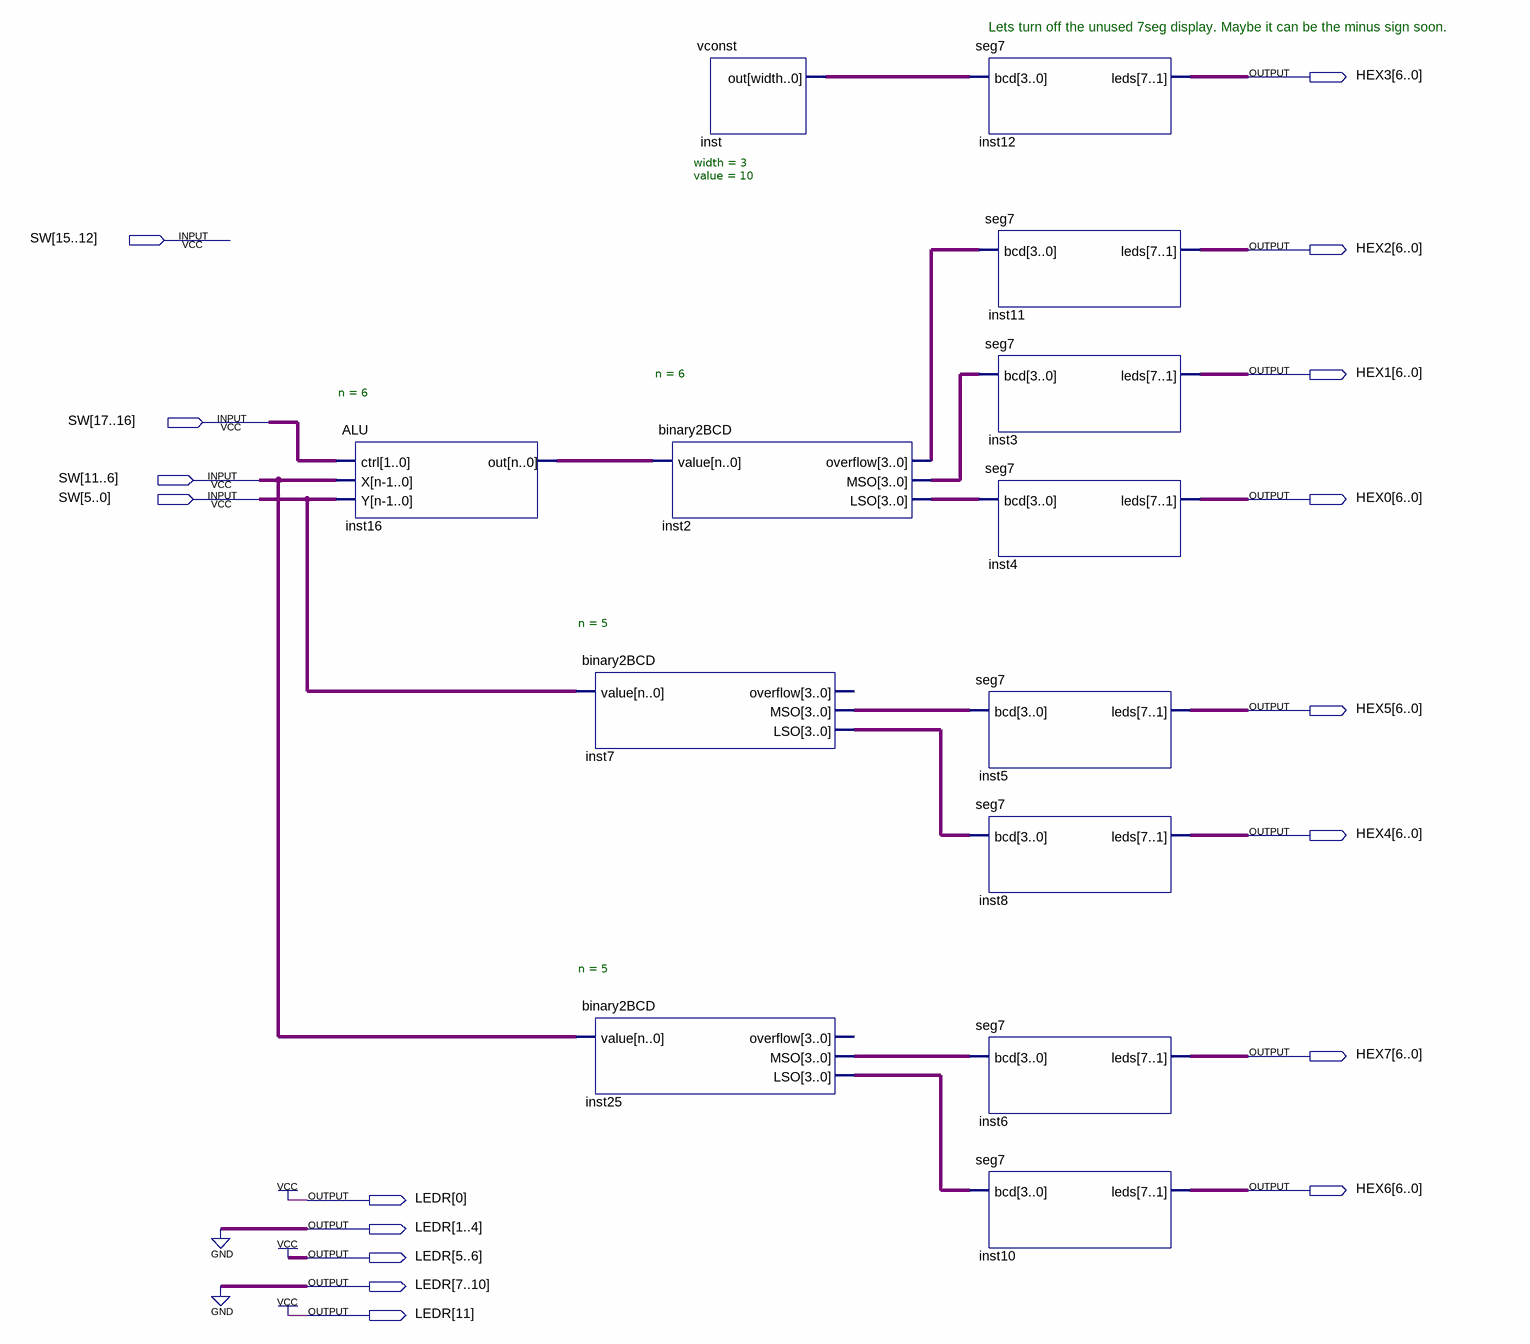
[diagram p0: schematic sheet]
// Quartus schematic lab1.bdf as structural Verilog: 13 symbols, 17 pins
module lab1 (
  input  [17:0] SW,
  output [6:0] HEX3,
  output [6:0] HEX2,
  output [6:0] HEX1,
  output [6:0] HEX0,
  output [6:0] HEX5,
  output [6:0] HEX4,
  output [6:0] HEX7,
  output [6:0] HEX6,
  output [0:11] LEDR
);

  wire [3:0] inst2_lso, inst2_mso, inst2_overflow, inst7_lso, inst7_mso, inst25_lso, inst25_mso, inst_out;
  wire [6:0] inst16_out;

  ALU #(.n(6)) inst16 (.ctrl(SW[17:16]), .X(SW[11:6]), .Y(SW[5:0]), .out(inst16_out));
  binary2BCD #(.n(5)) inst7 (.value(SW[5:0]), .MSO(inst7_mso), .LSO(inst7_lso));  // open: overflow
  binary2BCD #(.n(5)) inst25 (.value(SW[11:6]), .MSO(inst25_mso), .LSO(inst25_lso));  // open: overflow
  vconst #(.width(3), .value(10)) inst (.out(inst_out));
  binary2BCD #(.n(6)) inst2 (.value(inst16_out), .overflow(inst2_overflow), .MSO(inst2_mso), .LSO(inst2_lso));
  seg7 inst12 (.bcd(inst_out), .leds(HEX3));
  seg7 inst11 (.bcd(inst2_overflow), .leds(HEX2));
  seg7 inst3 (.bcd(inst2_mso), .leds(HEX1));
  seg7 inst4 (.bcd(inst2_lso), .leds(HEX0));
  seg7 inst5 (.bcd(inst7_mso), .leds(HEX5));
  seg7 inst8 (.bcd(inst7_lso), .leds(HEX4));
  seg7 inst6 (.bcd(inst25_mso), .leds(HEX7));
  seg7 inst10 (.bcd(inst25_lso), .leds(HEX6));

  assign LEDR = 12'b100001100001;

  // Notes on the sheet:
  //   Lets turn off the unused 7seg display. Maybe it can be the minus sign soon.
endmodule
